# EAGLE schematic CH340G adapter (EAGLE 9.5.2)
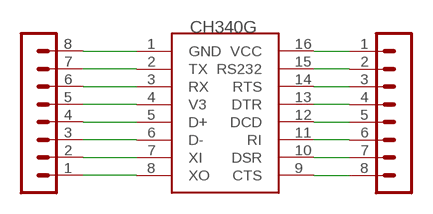
[diagram p0: schematic, sheet 1]

## Parts
SV1  MA08-1  [MA08-1]
SV2  MA08-1  [MA08-1]
U$1  CH340G  [SOIC16]

## Nets
N$1: SV1.8 U$1.1(GND)
N$2: SV1.7 U$1.2(TX)
N$3: SV1.6 U$1.3(RX)
N$4: SV1.5 U$1.4(V3)
N$5: SV1.4 U$1.5(D+)
N$6: SV1.3 U$1.6(D-)
N$7: SV1.2 U$1.7(XI)
N$8: SV1.1 U$1.8(XO)
N$9: SV2.8 U$1.9(CTS)
N$10: SV2.7 U$1.10(DSR)
N$11: SV2.6 U$1.11(RI)
N$12: SV2.5 U$1.12(DCD)
N$13: SV2.4 U$1.13(DTR)
N$14: SV2.3 U$1.14(RTS)
N$15: SV2.2 U$1.15(RS232)
N$16: SV2.1 U$1.16(VCC)

## Library data of the parts
SV1 SV2 = con-lstb:MA08-1: PIN HEADER; OC_FARNELL: unknown; OC_NEWARK: unknown
U$1 = ch340g:CH340G